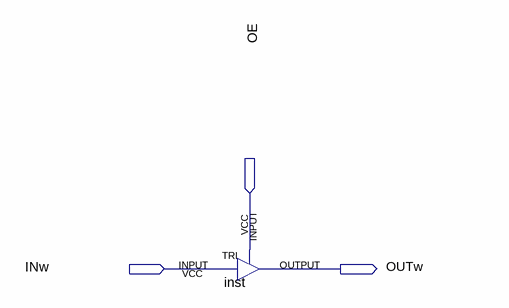
[diagram p0: schematic sheet]
// Quartus schematic Test.bdf as structural Verilog: 1 symbols, 3 pins
module Test (
  input  OE,
  input  INw,
  output OUTw
);

  TRI inst (.IN(INw), .OE(OE), .OUT(OUTw));
endmodule
